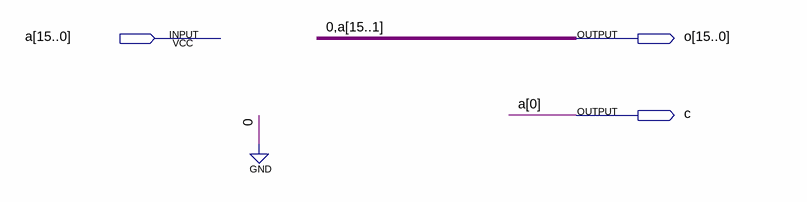
[diagram p0: schematic sheet]
// Quartus schematic LOG_SR16.bdf as structural Verilog: 0 symbols, 3 pins
module LOG_SR16 (
  input  [15:0] a,
  output [15:0] o,
  output c
);


  assign c = a[0];
  assign o = {1'b0, a[15:1]};
endmodule
